# Altium schematic sheet idro900ma.SchDoc
size A
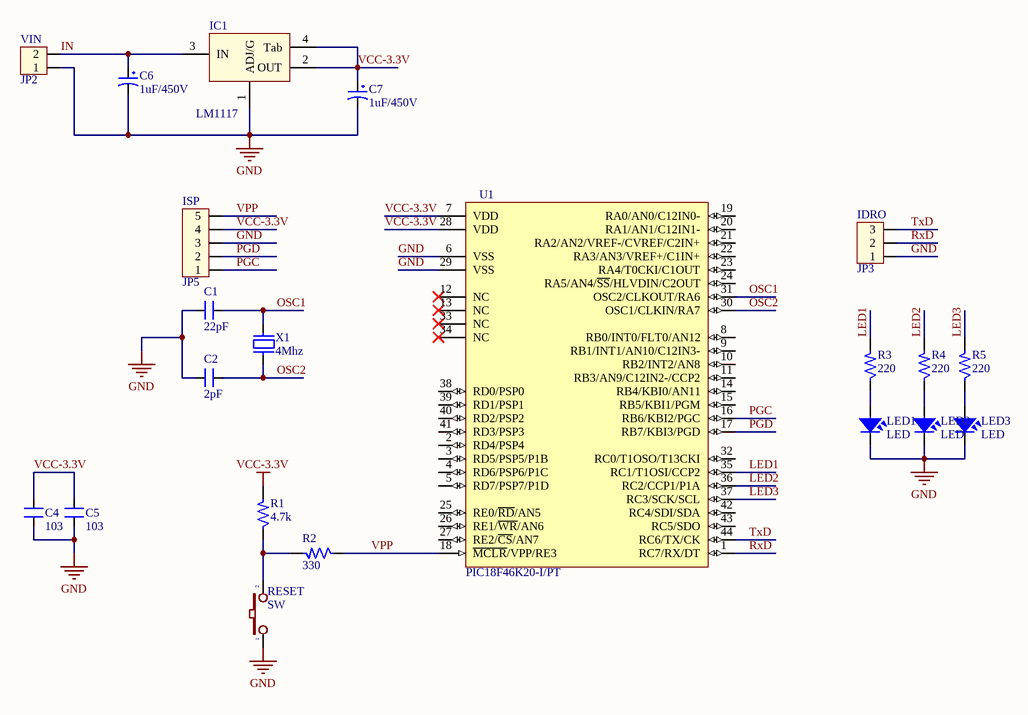
[diagram p0: idro900ma.SchDoc]

## Parts
C1  22pF  [SM-0805]
C2  2pF  [SM-0805]
C4  103  [SM-0805]
C5  103  [SM-0805]
C6  1uF/450V  [SM-0805]
C7  1uF/450V  [SM-0805]
IC1  LM1117  [SOT223-4N]
IDRO  JP3  [CON3]
ISP  JP5  [CON5]
LED1  LED  [LED-5 GRe]
LED2  LED  [LED-5 GRe]
LED3  LED  [LED-5 GRe]
R1  4.7k  [SM-0805]
R2  330  [SM-0805]
R3  220  [SM-0805]
R4  220  [SM-0805]
R5  220  [SM-0805]
RESET  SW  [SW2]
U1  PIC18F46K20-I/PT  [TQFP-PT44_N]
VIN  JP2  [CON2]
X1  4Mhz  [XT2]

## Nets
GND: C1.1 C2.1 C4.1 C5.1 C6.2 C7.2 IC1.1(ADJ/G) IDRO.1 ISP.3 LED1.2 LED2.2 LED3.2 RESET.1 U1.6(VSS) U1.29(VSS) VIN.1
VCC-3.3V: C4.2 C5.2 C7.1 IC1.2(OUT) IC1.4(Tab) ISP.4 R1.2 U1.7(VDD) U1.28(VDD)
IN: C6.1 IC1.3(IN) VIN.2
LED1: R3.2 U1.35(RC1/T1OSI/CCP2)
LED2: R4.2 U1.36(RC2/CCP1/P1A)
LED3: R5.2 U1.37(RC3/SCK/SCL)
OSC1: C1.2 U1.31(OSC2/CLKOUT/RA6) X1.2
OSC2: C2.2 U1.30(OSC1/CLKIN/RA7) X1.1
PGC: ISP.1 U1.16(RB6/KBI2/PGC)
PGD: ISP.2 U1.17(RB7/KBI3/PGD)
RxD: IDRO.2 U1.1(RC7/RX/DT)
TxD: IDRO.3 U1.44(RC6/TX/CK)
VPP: ISP.5 R2.1 U1.18(~{MCLR}/VPP/RE3)
NetLED1_1: LED1.1 R3.1
NetLED2_1: LED2.1 R4.1
NetLED3_1: LED3.1 R5.1
NetR1_1: R1.1 R2.2 RESET.2

Not connected (* = marked no-connect by the designer): U1 2(RD4/PSP4) 3(RD5/PSP5/P1B) 4(RD6/PSP6/P1C) 5(RD7/PSP7/P1D) 8(RB0/INT0/FLT0/AN12) 9(RB1/INT1/AN10/C12IN3-) 10(RB2/INT2/AN8) 11(RB3/AN9/C12IN2-/CCP2) 12(NC)* 13(NC)* 14(RB4/KBI0/AN11) 15(RB5/KBI1/PGM) 19(RA0/AN0/C12IN0-) 20(RA1/AN1/C12IN1-) 21(RA2/AN2/VREF-/CVREF/C2IN+) 22(RA3/AN3/VREF+/C1IN+) 23(RA4/T0CKI/C1OUT) 24(RA5/AN4/~{SS}/HLVDIN/C2OUT) 25(RE0/~{RD}/AN5) 26(RE1/~{WR}/AN6) 27(RE2/~{CS}/AN7) 32(RC0/T1OSO/T13CKI) 33(NC)* 34(NC)* 38(RD0/PSP0) 39(RD1/PSP1) 40(RD2/PSP2) 41(RD3/PSP3) 42(RC4/SDI/SDA) 43(RC5/SDO)

## Library data of the parts
C1 C2 = CM: Cap SMD; Value: 103
C4 C5 = CM: Cap SMD; Value: 103
C6 C7 = CP8: Cap 4700uF/50V; Value: 220uF/450V
IC1 = LM1117: 3v3; Value: LM317
IDRO = Con3: Connector 3; Value: Connector 3
ISP = Con5: Connector 5; Value: Connector 5
LED1-LED3 = LED: LED Single colour Green and Red; Value: LED 3 ly Single Colour
R1-R5 = R: Resistor 1/4W; Value: R1/4W - 1K
RESET = SW2: Switch button 2 pin; Value: SW chip 2 pin
U1 = PIC18F46K20-I/PT: Flash Microcontroller with 10-Bit A/D and nanoWatt Technology, 32K Flash, 44-Pin TQFP, Industrial Temperature Range; Published: 2-Dec-2009; DatasheetVersion: revF, Sep-2009; PackageVersion: revBB, Aug-2009; PackageReference: TQFP-PT44; Publisher: Altium Limited; PackageDescription: 44-Lead Plastic Thin Quad Flatpack (PT) - 10x10x1mm Body, 2.00mm [TQFP]; Supplier 1: Digi-Key; Supplier Part Number 1: PIC18F46K20-I/PT-ND; Supplier 2: Farnell; Supplier Part Number 2: 1439591; Code_JEDEC: MS-026; ComponentLink1Description: Datasheet; ComponentLink1URL: http://ww1.microchip.com/downloads/en/DeviceDoc/41303F.pdf; ComponentLink2Description: Packaging Specification; ComponentLink2URL: http://www.microchip.com/stellent/groups/techpub_sg/documents/packagingspec/en012702.pdf; ComponentLink3Description: Microchip.com Home; ComponentLink3URL: http://www.microchip.com/
VIN = Con2: Connector 2; Value: Connector 2
X1 = XT2: Crystal For all Crystal 2pin.; Value: 4Mhz